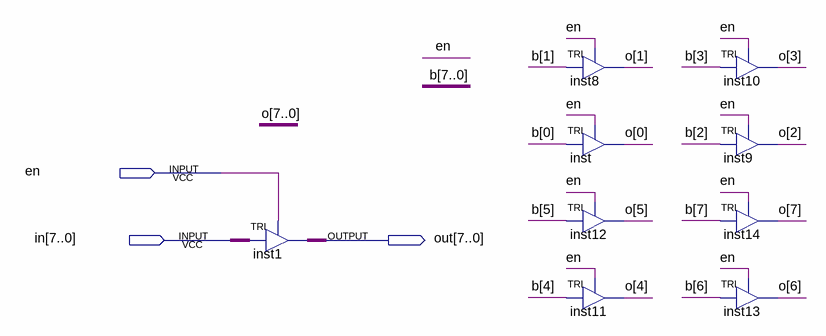
[diagram p0: schematic sheet]
// Quartus schematic tri8.bdf as structural Verilog: 9 symbols, 3 pins
module tri8 (
  input  en,
  input  [7:0] in,
  output [7:0] out
);

  wire [7:0] b, o;

  TRI inst1[7:0] (.IN(in), .OE(en), .OUT(out));
  TRI inst8 (.IN(b[1]), .OE(en), .OUT(o[1]));
  TRI inst (.IN(b[0]), .OE(en), .OUT(o[0]));
  TRI inst12 (.IN(b[5]), .OE(en), .OUT(o[5]));
  TRI inst11 (.IN(b[4]), .OE(en), .OUT(o[4]));
  TRI inst10 (.IN(b[3]), .OE(en), .OUT(o[3]));
  TRI inst9 (.IN(b[2]), .OE(en), .OUT(o[2]));
  TRI inst14 (.IN(b[7]), .OE(en), .OUT(o[7]));
  TRI inst13 (.IN(b[6]), .OE(en), .OUT(o[6]));
endmodule
